# EAGLE schematic codec_controller (EAGLE 6.4)
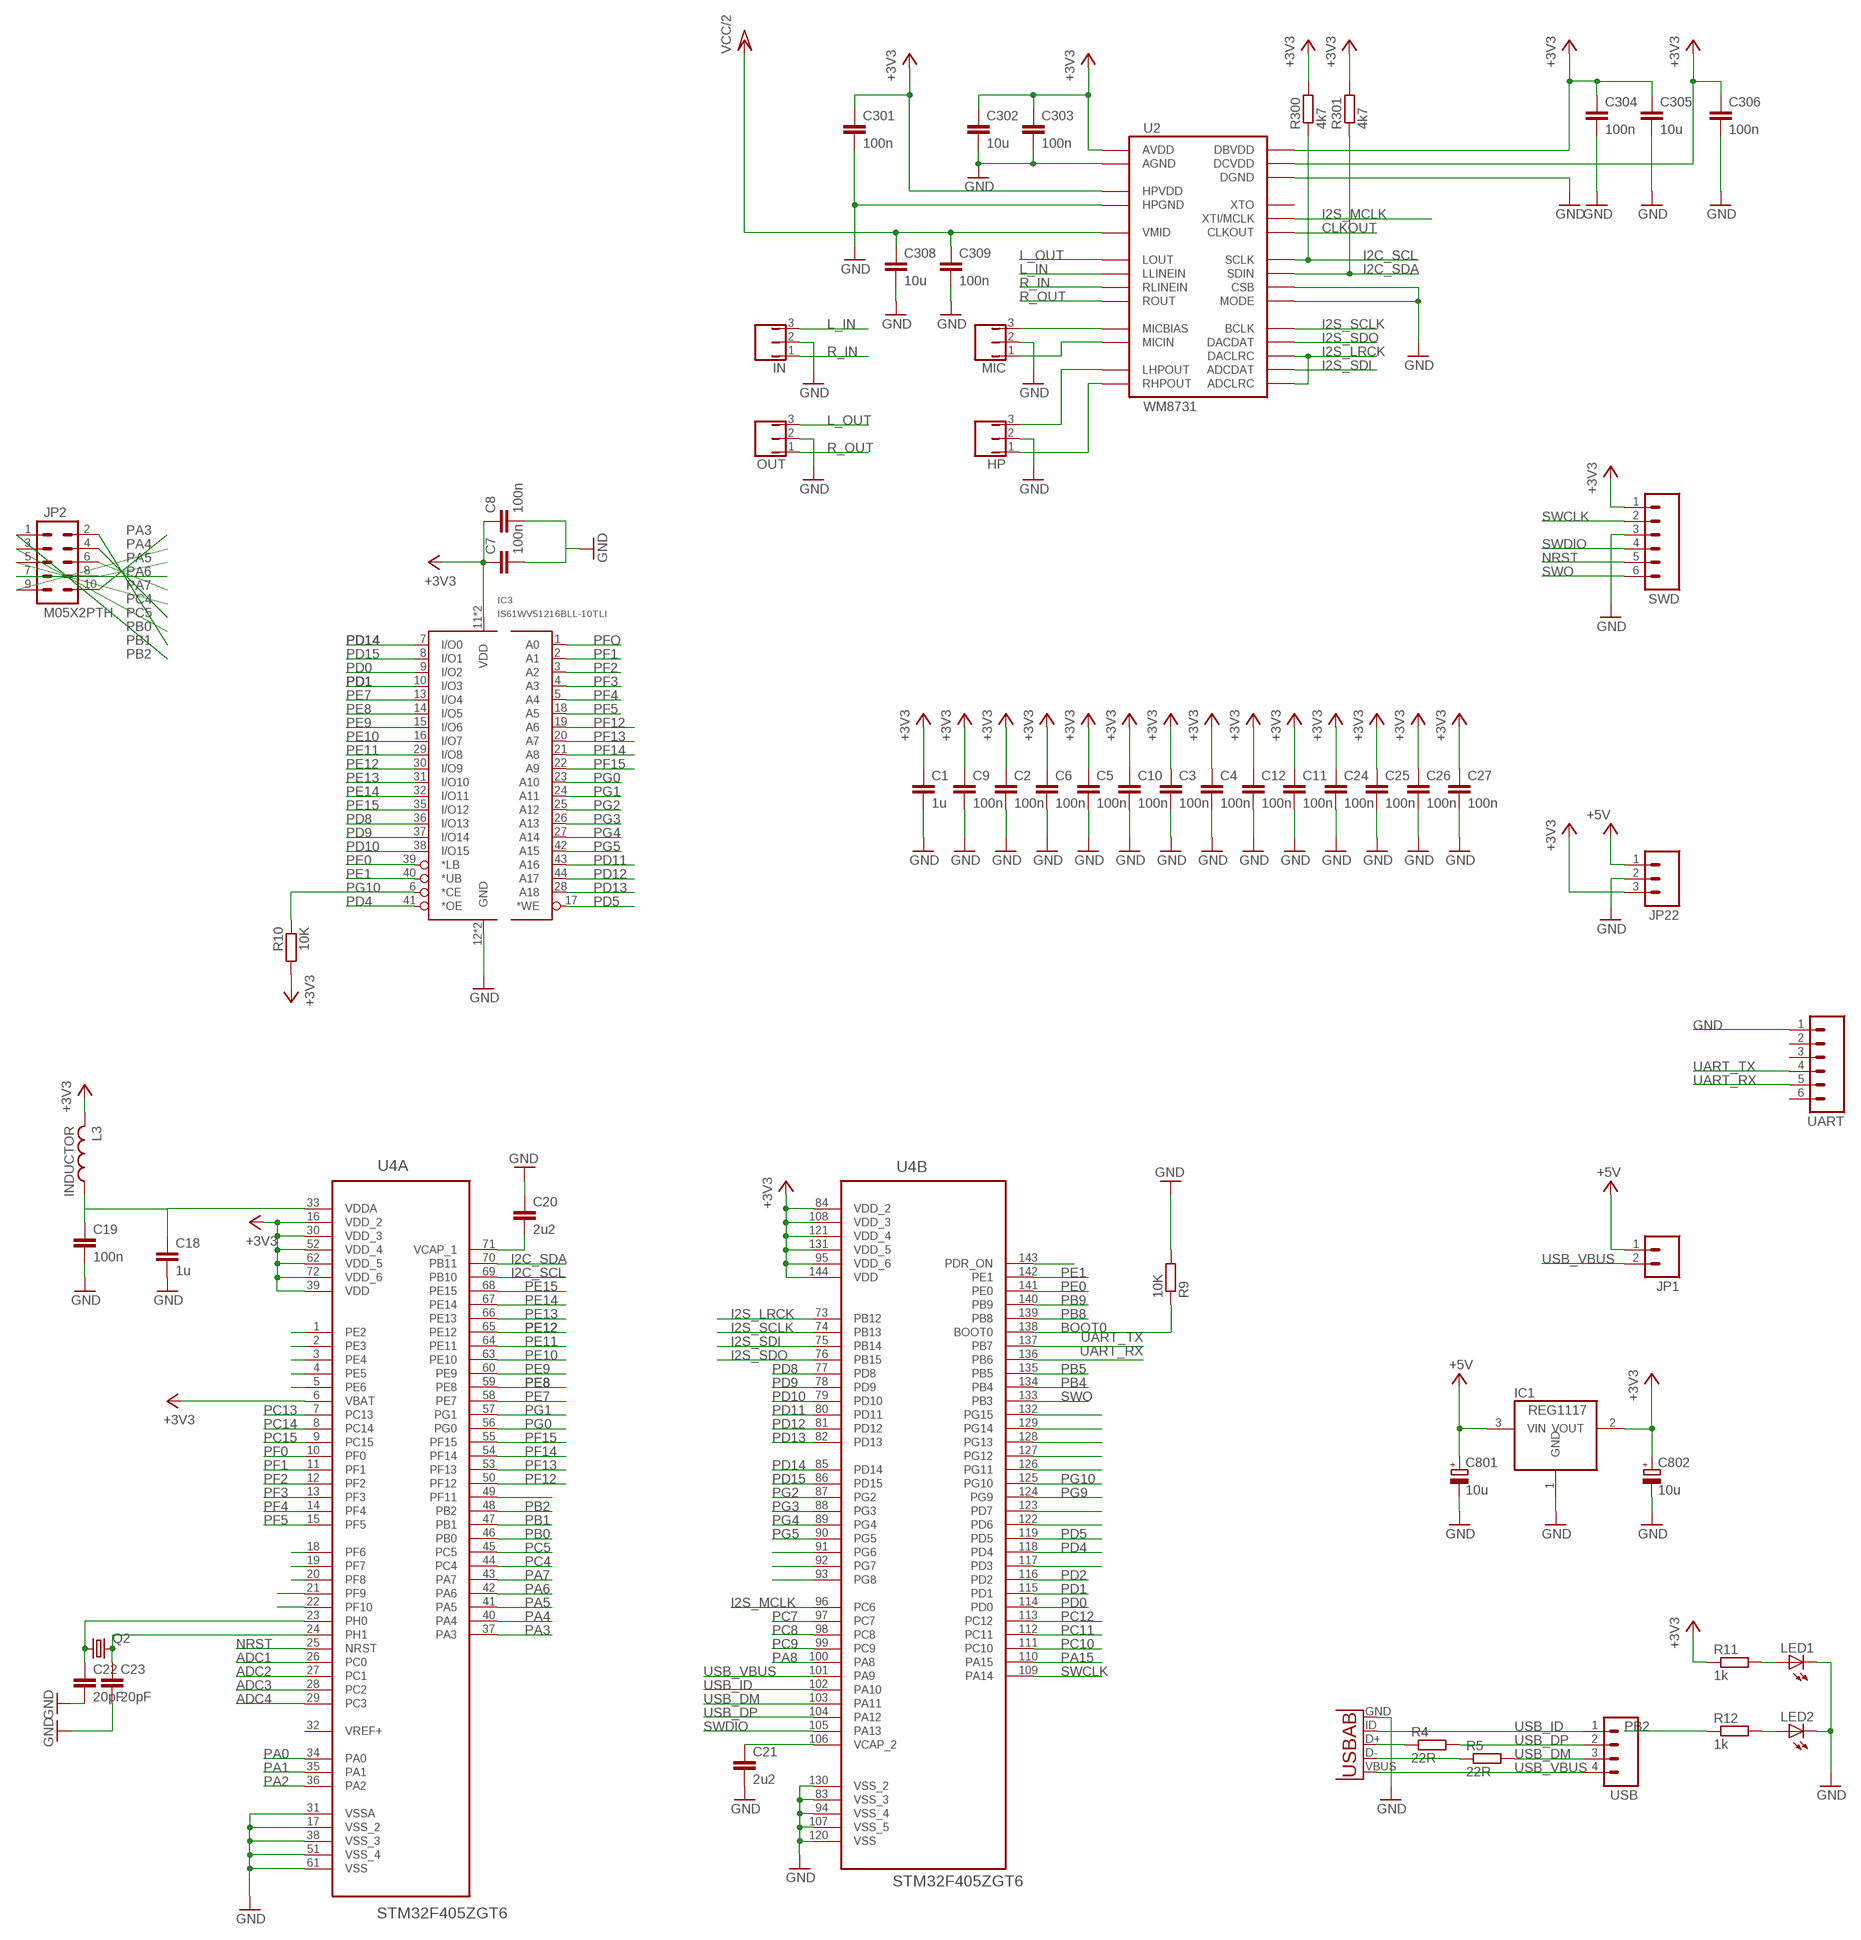
[diagram p0: schematic, sheet 1]

## Parts
C1  1u  C-EUC0603  [C0603]
C2  100n  C-EUC0603  [C0603]
C3  100n  C-EUC0603  [C0603]
C4  100n  C-EUC0603  [C0603]
C5  100n  C-EUC0603  [C0603]
C6  100n  C-EUC0603  [C0603]
C7  100n  C-EUC0603  [C0603]
C8  100n  C-EUC0603  [C0603]
C9  100n  C-EUC0603  [C0603]
C10  100n  C-EUC0603  [C0603]
C11  100n  C-EUC0603  [C0603]
C12  100n  C-EUC0603  [C0603]
C18  1u  C-EUC0603  [C0603]
C19  100n  C-EUC0603  [C0603]
C20  2u2  C-EUC0603  [C0603]
C21  2u2  C-EUC0603  [C0603]
C22  20pF  C-EUC0603  [C0603]
C23  20pF  C-EUC0603  [C0603]
C24  100n  C-EUC0603  [C0603]
C25  100n  C-EUC0603  [C0603]
C26  100n  C-EUC0603  [C0603]
C27  100n  C-EUC0603  [C0603]
C301  100n  C-EUC0603  [C0603]
C302  10u  C-EUC1206  [C1206]
C303  100n  C-EUC0603  [C0603]
C304  100n  C-EUC0603  [C0603]
C305  10u  C-EUC1206  [C1206]
C306  100n  C-EUC0603  [C0603]
C308  10u  C-EUC1206  [C1206]
C309  100n  C-EUC0603  [C0603]
C801  10u  CPOL-EUA  [PANASONIC_A]
C802  10u  CPOL-EUA  [PANASONIC_A]
HP  JMP/3P/SIP  [JMP/3P/SIP]
IC1  REG1117  [SOT223]
IC3  IS61WV51216BLL-10TLI  [TSOP44-II]
IN  JMP/3P/SIP  [JMP/3P/SIP]
JP1  M02PTH  [1X02]
JP2  M05X2PTH  [AVR_ICSP]
JP22  M03PTH  [1X03]
L3  INDUCTOR  [0603]
LED1  LED1206  [LED-1206]
LED2  LED1206  [LED-1206]
MIC  JMP/3P/SIP  [JMP/3P/SIP]
OUT  JMP/3P/SIP  [JMP/3P/SIP]
Q2  CRYSTALHC49UP  [HC49UP]
R4  22R  R-EU_R0603  [R0603]
R5  22R  R-EU_R0603  [R0603]
R9  10K  R-EU_R0603  [R0603]
R10  10K  R-EU_R0603  [R0603]
R11  1k  R-EU_R0603  [R0603]
R12  1k  R-EU_R0603  [R0603]
R300  4k7  R-EU_R0603  [R0603]
R301  4k7  R-EU_R0603  [R0603]
SWD  M06SIP  [1X06]
U2  WM8731  [28-SSOP]
U3  USB-AB  [USB-AB-MICRO-SMD]
U4  STM32F405ZGT6  [QFP50P2200X2200X160-144N]
UART  M06SIP  [1X06]
USB  M04PTH  [1X04]

## Nets
+3V3: C1.1 C2.1 C3.1 C4.1 C5.1 C6.1 C7.1 C8.1 C9.1 C10.1 C11.1 C12.1 C24.1 C25.1 C26.1 C27.1 C301.1 C302.1 C303.1 C304.1 C305.1 C306.1 C802.+ IC1.2(VOUT) IC3.11(VDD) IC3.33(VDD) JP22.3 L3.2 R10.2 R11.1 R300.2 R301.2 SWD.1 U2.P$1(DBVDD) U2.P$8(HPVDD) U2.P$14(AVDD) U2.P$27(DCVDD) U4.6(A:VBAT) U4.16(A:VDD_2) U4.30(A:VDD_3) U4.39(A:VDD) U4.52(A:VDD_4) U4.62(A:VDD_5) U4.72(A:VDD_6) U4.84(B:VDD_2) U4.95(B:VDD_6) U4.108(B:VDD_3) U4.121(B:VDD_4) U4.131(B:VDD_5) U4.144(B:VDD)
+5V: C801.+ IC1.3(VIN) JP1.1 JP22.1
ADC1: U4.26(A:PC0)
ADC2: U4.27(A:PC1)
ADC3: U4.28(A:PC2)
ADC4: U4.29(A:PC3)
BOOT0: R9.1 U4.138(B:BOOT0)
CLKOUT: U2.P$2(CLKOUT)
GND: C1.2 C2.2 C3.2 C4.2 C5.2 C6.2 C7.2 C8.2 C9.2 C10.2 C11.2 C12.2 C18.2 C19.2 C20.1 C21.2 C22.2 C23.2 C24.2 C25.2 C26.2 C27.2 C301.2 C302.2 C303.2 C304.2 C305.2 C306.2 C308.2 C309.2 C801.- C802.- HP.2 IC1.1(GND) IC3.12(GND) IC3.34(GND) IN.2 JP22.2 LED1.C LED2.C MIC.2 OUT.2 R9.2 SWD.3 U2.P$11(HPGND) U2.P$15(AGND) U2.P$21(MODE) U2.P$22(CSB) U2.P$28(DGND) U3.GND U4.17(A:VSS_2) U4.31(A:VSSA) U4.38(A:VSS_3) U4.51(A:VSS_4) U4.61(A:VSS) U4.83(B:VSS_3) U4.94(B:VSS_4) U4.107(B:VSS_5) U4.120(B:VSS) U4.130(B:VSS_2) UART.1
I2C_SCL: R300.1 U2.P$24(SCLK) U4.69(A:PB10)
I2C_SDA: R301.1 U2.P$23(SDIN) U4.70(A:PB11)
I2S_LRCK: U2.P$5(DACLRC) U2.P$7(ADCLRC) U4.73(B:PB12)
I2S_MCLK: U2.P$25(XTI/MCLK) U4.96(B:PC6)
I2S_SCLK: U2.P$3(BCLK) U4.74(B:PB13)
I2S_SDI: U2.P$6(ADCDAT) U4.75(B:PB14)
I2S_SDO: U2.P$4(DACDAT) U4.76(B:PB15)
L_IN: IN.3 U2.P$20(LLINEIN)
L_OUT: OUT.3 U2.P$12(LOUT)
N$1: MIC.3 U2.P$17(MICBIAS)
N$6: U4.49(A:PF11)
N$8: HP.3 U2.P$9(LHPOUT)
N$10: LED1.A R11.2
N$11: LED2.A R12.2
N$14: U4.21(A:PF9)
N$15: U4.22(A:PF10)
N$17: R4.1 U3.D+
N$21: R5.1 U3.D-
N$23: C23.1 Q2.2 U4.24(A:PH1)
N$24: C22.1 Q2.1 U4.23(A:PH0)
N$43: MIC.1 U2.P$18(MICIN)
N$44: HP.1 U2.P$10(RHPOUT)
N$54: U4.91(B:PG6)
N$75: U4.128(B:PG13)
N$76: U4.129(B:PG14)
N$77: U4.132(B:PG15)
N$99: U4.117(B:PD3)
N$102: U4.122(B:PD6)
N$103: U4.123(B:PD7)
N$106: U4.126(B:PG11)
N$107: U4.127(B:PG12)
N$113: U4.143(B:PDR_ON)
N$123: U4.19(A:PF7)
N$124: U4.18(A:PF6)
N$136: U4.5(A:PE6)
N$137: U4.4(A:PE5)
N$138: U4.3(A:PE4)
N$139: U4.2(A:PE3)
N$140: U4.1(A:PE2)
N$142: U4.93(B:PG8)
N$143: U4.92(B:PG7)
NRST: SWD.5 U4.25(A:NRST)
PA0: U4.34(A:PA0)
PA1: U4.35(A:PA1)
PA2: U4.36(A:PA2)
PA3: JP2.10 U4.37(A:PA3)
PA4: JP2.9 U4.40(A:PA4)
PA5: JP2.8 U4.41(A:PA5)
PA6: JP2.7 U4.42(A:PA6)
PA7: JP2.6 U4.43(A:PA7)
PA8: U4.100(B:PA8)
PA15: U4.110(B:PA15)
PB0: JP2.3 U4.46(A:PB0)
PB1: JP2.2 U4.47(A:PB1)
PB2: JP2.1 R12.1 U4.48(A:PB2)
PB4: U4.134(B:PB4)
PB5: U4.135(B:PB5)
PB8: U4.139(B:PB8)
PB9: U4.140(B:PB9)
PC4: JP2.5 U4.44(A:PC4)
PC5: JP2.4 U4.45(A:PC5)
PC7: U4.97(B:PC7)
PC8: U4.98(B:PC8)
PC9: U4.99(B:PC9)
PC10: U4.111(B:PC10)
PC11: U4.112(B:PC11)
PC12: U4.113(B:PC12)
PC13: U4.7(A:PC13)
PC14: U4.8(A:PC14)
PC15: U4.9(A:PC15)
PD0: IC3.9(I/O2) U4.114(B:PD0)
PD1: IC3.10(I/O3) U4.115(B:PD1)
PD2: U4.116(B:PD2)
PD4: IC3.41(*OE) U4.118(B:PD4)
PD5: IC3.17(*WE) U4.119(B:PD5)
PD8: IC3.36(I/O13) U4.77(B:PD8)
PD9: IC3.37(I/O14) U4.78(B:PD9)
PD10: IC3.38(I/O15) U4.79(B:PD10)
PD11: IC3.43(A16) U4.80(B:PD11)
PD12: IC3.44(A17) U4.81(B:PD12)
PD13: IC3.28(A18) U4.82(B:PD13)
PD14: IC3.7(I/O0) U4.85(B:PD14)
PD15: IC3.8(I/O1) U4.86(B:PD15)
PE0: IC3.39(*LB) U4.141(B:PE0)
PE1: IC3.40(*UB) U4.142(B:PE1)
PE7: IC3.13(I/O4) U4.58(A:PE7)
PE8: IC3.14(I/O5) U4.59(A:PE8)
PE9: IC3.15(I/O6) U4.60(A:PE9)
PE10: IC3.16(I/O7) U4.63(A:PE10)
PE11: IC3.29(I/O8) U4.64(A:PE11)
PE12: IC3.30(I/O9) U4.65(A:PE12)
PE13: IC3.31(I/O10) U4.66(A:PE13)
PE14: IC3.32(I/O11) U4.67(A:PE14)
PE15: IC3.35(I/O12) U4.68(A:PE15)
PF0: U4.10(A:PF0)
PF1: IC3.2(A1) U4.11(A:PF1)
PF2: IC3.3(A2) U4.12(A:PF2)
PF3: IC3.4(A3) U4.13(A:PF3)
PF4: IC3.5(A4) U4.14(A:PF4)
PF5: IC3.18(A5) U4.15(A:PF5)
PF9: U4.20(A:PF8)
PF12: IC3.19(A6) U4.50(A:PF12)
PF13: IC3.20(A7) U4.53(A:PF13)
PF14: IC3.21(A8) U4.54(A:PF14)
PF15: IC3.22(A9) U4.55(A:PF15)
PFO: IC3.1(A0)
PG0: IC3.23(A10) U4.56(A:PG0)
PG1: IC3.24(A11) U4.57(A:PG1)
PG2: IC3.25(A12) U4.87(B:PG2)
PG3: IC3.26(A13) U4.88(B:PG3)
PG4: IC3.27(A14) U4.89(B:PG4)
PG5: IC3.42(A15) U4.90(B:PG5)
PG9: U4.124(B:PG9)
PG10: IC3.6(*CE) R10.1 U4.125(B:PG10)
R_IN: IN.1 U2.P$19(RLINEIN)
R_OUT: OUT.1 U2.P$13(ROUT)
SWCLK: SWD.2 U4.109(B:PA14)
SWDIO: SWD.4 U4.105(B:PA13)
SWO: SWD.6 U4.133(B:PB3)
UART_RX: U4.136(B:PB6) UART.5
UART_TX: U4.137(B:PB7) UART.4
USB_DM: R5.2 U4.103(B:PA11) USB.3
USB_DP: R4.2 U4.104(B:PA12) USB.2
USB_ID: U3.ID(USBID) U4.102(B:PA10) USB.1
USB_VBUS: JP1.2 U3.VBUS U4.101(B:PA9) USB.4
VCAP1: C20.2 U4.71(A:VCAP_1)
VCAP2: C21.1 U4.106(B:VCAP_2)
VCC/2: C308.1 C309.1 U2.P$16(VMID)
VDDA: C18.1 C19.1 L3.1 U4.33(A:VDDA)
Unconnected: U2.P$26(XTO) U4.32(A:VREF+) UART.2 UART.3 UART.6

## Library data of the parts
C1-C12 C18-C27 C301-C306 C308 C309 = resistor:C-EU: CAPACITOR, European symbol
C801 C802 = resistor:CPOL-EU: POLARIZED CAPACITOR, European symbol
HP IN MIC OUT = audioint:JMP/3P/SIP
IC1 = burr-brown:REG1117: 800mA and 1A Low Dropout (LDO) Positive Regulator 1.8V, 2.5V, 2.85V, 3.3V, 5V, and Adj; MPN: REG1117; OC_FARNELL: 1097566; OC_NEWARK: 14P6981
IC3 = Rebel:IS61WV51216BLL-10TLI: IS61WV51216BLL-10TLI - SRAM, 8MBIT, 10NS, 44TSOPII Manufacturer: INTEGRATED SILICON SOLUTION (ISSI) Farnell order code: 2253837 Manufacturer Part No: IS61WV51216BLL-10TLI Product Information SRAM, 8MBIT, 10NS, 44TSOPII Memory Size: 8Mbit Memory Configuration: 512K x 16bit Supply Voltage Min: 2.4V Supply Voltage Max: 3.6V Memory Case Style: TSOPII No. of Pins: 44 Access Time: 10ns Operating Temperature Min: -40°C Operating Temperature Max: 85°C MSL: MSL 3 - 168 hours SVHC: No SVHC (19-Dec-2012) Operating Temperature Range: -40°C to +85°C Supply Voltage Range: 2.4V to 3.6V
JP1 = SparkFun:M02: Header 2 Standard 2-pin 0.1" header. Use with straight break away headers (SKU : PRT-00116), right angle break away headers (PRT-00553), swiss pins (PRT-00743), machine pins (PRT-00117), and female headers (PRT-00115). Molex polarized connector foot print use with SKU : PRT-08233 with associated crimp pins and housings.
JP2 = SparkFun:M05X2: Header 5x2 Standard 10-pin dual row 0.1" header. Commonly used with AVR-ISP. Use with Spark Fun Electronics SKU: PRT-00778
JP22 = SparkFun:M03: Header 3 Standard 3-pin 0.1" header. Use with straight break away headers (SKU : PRT-00116), right angle break away headers (PRT-00553), swiss pins (PRT-00743), machine pins (PRT-00117), and female headers (PRT-00115). Molex polarized connector foot print use with SKU : PRT-08232 with associated crimp pins and housings.
L3 = Rebel:INDUCTOR
LED1 LED2 = SparkFun:LED: LEDs Standard schematic elements and footprints for 5mm, 3mm, 1206, and 0603 sized LEDs. 5mm - Spark Fun Electronics SKU : COM-00529 (and others)
Q2 = crystal:CRYSTAL: CRYSTAL; OC_FARNELL: unknown; OC_NEWARK: unknown
R4 R5 R9-R12 R300 R301 = resistor:R-EU_: RESISTOR, European symbol
SWD UART = SparkFun:M06: Header 6 Standard 6-pin 0.1" header. Use with straight break away headers (SKU : PRT-00116), right angle break away headers (PRT-00553), swiss pins (PRT-00743), machine pins (PRT-00117), and female headers (PRT-00115). Molex polarized connector foot print use with SKU : PRT-08094 with associated crimp pins and housings. NOTES ON THE VARIANTS LOCK and LOCK_LONGPADS... This footprint was designed to help hold the alignment of a through-hole component (i.e. 6-pin header) while soldering it into place. You may notice that each hole has been shifted either up or down by 0.005 of an inch from it's more standard position (which is a perfectly straight line). This slight alteration caused the pins (the squares in the middle) to touch the edges of the holes. Because they are alternating, it causes a "brace" to hold the component in place. 0.005 has proven to be the perfect amount of "off-center" position when using our standard breakaway headers. Although looks a little odd when you look at the bare footprint, once you have a header in there, the alteration is very hard to notice. Also, if you push a header all the way into place, it is covered up entirely on the bottom side. This idea of altering the position of holes to aid alignment will be further integrated into the Sparkfun Library for other footprints. It can help hold any component with 3 or more connection pins.
U2 = audioint:WM8731
U3 = SparkFun-Connectors:USB-AB: This is a USB AB connector that is compatible with USB OTG. i.e. this connector can serve as a host or device
U4 = Rebel:STM32F405ZGT6: IC, MCU, 32BIT, 1MB FLASH, 144LQFP; MPN: STM32F405ZGT6; OC_FARNELL: 2215225; OC_NEWARK: 46W2200; PACKAGE: 144LQFP; SUPPLIER: STMicroelectronics
USB = SparkFun:M04: Header 4 Standard 4-pin 0.1" header. Use with straight break away headers (SKU : PRT-00116), right angle break away headers (PRT-00553), swiss pins (PRT-00743), machine pins (PRT-00117), and female headers (PRT-00115). Molex polarized connector foot print use with SKU : PRT-08231 with associated crimp pins and housings. 1MM SMD Version SKU: PRT-10208